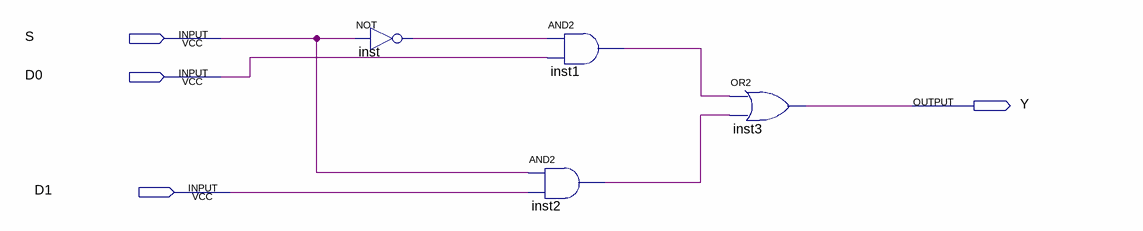
[diagram p0: schematic sheet]
// Quartus schematic Mux2to1.bdf as structural Verilog: 4 symbols, 4 pins
module Mux2to1 (
  input  S,
  input  D0,
  input  D1,
  output Y
);

  wire inst1_out, inst2_out, inst_out;

  not inst (inst_out, S);
  and inst1 (inst1_out, inst_out, D0);
  and inst2 (inst2_out, S, D1);
  or inst3 (Y, inst1_out, inst2_out);
endmodule
